# Altium schematic sheet Battery System.SchDoc
size A4; SheetNumber: 3; SheetTotal: 5
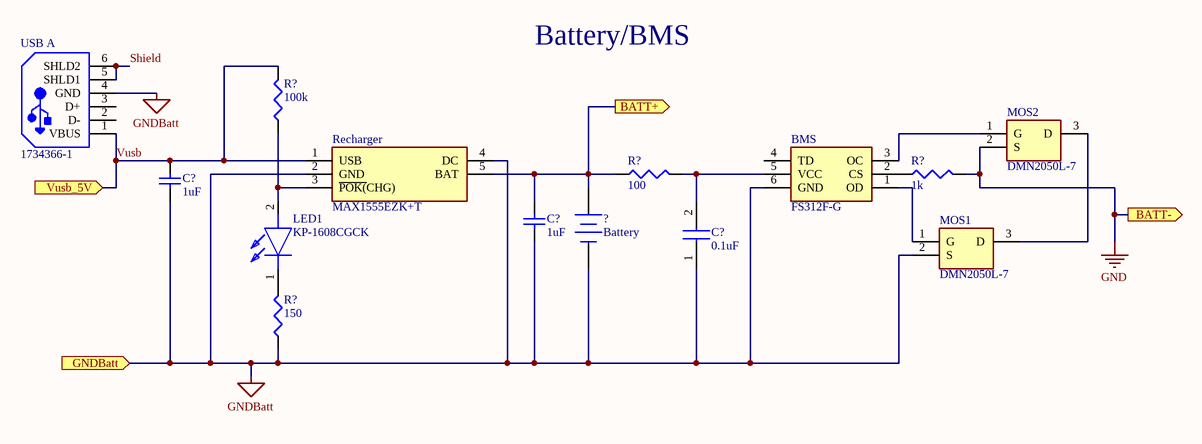
[diagram p0: Battery System.SchDoc]

## Parts
(Parts that share a designator on the sheet are numbered #1, #2 ... from top to bottom, then left to right.)
?  Battery  [BAT-2]
BMS  FS312F-G  [SOT95P280X145-6N]
C?#1  1uF  [CAPC1608X90X35ML15T15]
C?#2  1uF  [CAPC1608X90X35ML15T15]
C?#3  0.1uF  [CAPC3216X180N]
LED1  KP-1608CGCK  [LEDC1608X120N]
MOS1  DMN2050L-7  [SOT96P240X120-3N]
MOS2  DMN2050L-7  [SOT96P240X120-3N]
R?#1  value 100k  [J1-0603]  (hidden comment: Res3)
R?#2  value 100  [J1-0603]  (hidden comment: Res3)
R?#3  value 1k  [J1-0603]  (hidden comment: Res3)
R?#4  value 150  [J1-0603]  (hidden comment: Res3)
Recharger  MAX1555EZK+T  [SOT95P275X110-5N]
USB_A  1734366-1  [TE-1734366-1_V]

## Ports
BATT+ (out), BATT- (out), GNDBatt (in), Vusb_5V (in)

## Nets
GND: MOS2.2(S) R?#3.2 ; port BATT-
GNDBatt: ?.2(-) BMS.6(GND) C?#1.1 C?#2.1 C?#3.1 MOS1.2(S) R?#4.1 Recharger.2(GND) Recharger.4(DC) USB_A.4(GND) ; port GNDBatt
BATT+: ?.1(+) C?#2.2 R?#2.1 Recharger.5(BAT) ; port BATT+
Shield: USB_A.5(SHLD1) USB_A.6(SHLD2)
Vusb: C?#1.2 R?#1.2 Recharger.1(USB) USB_A.1(VBUS) ; port Vusb_5V
NetBMS_1: BMS.1(OD) MOS1.1(G)
NetBMS_2: BMS.2(CS) R?#3.1
NetBMS_3: BMS.3(OC) MOS2.1(G)
NetBMS_5: BMS.5(VCC) C?#3.2 R?#2.2
NetLED1_1: LED1.1(K) R?#4.2
NetLED1_2: LED1.2(A) R?#1.1 Recharger.3(~{POK(}CHG))
NetMOS1_3: MOS1.3(D) MOS2.3(D)

Not connected (* = marked no-connect by the designer): BMS 4(TD); USB_A 2(D-) 3(D+)

## Notes on the sheet
- Battery/BMS

## Library data of the parts
? = Battery: Multicell Battery; Published: 24-Mar-1999; LatestRevisionDate: 17-Jul-2002; LatestRevisionNote: Re-released for DXP Platform.; PackageReference: BAT-2; Publisher: Altium Limited; PackageDescription: Battery; 2 Leads
BMS = FS312F-G: Integrated Circuit; Manufacturer_Name: Fortune Semiconductor Corporation; Datasheet Link: https://www.ic-fortune.com/upload/Download/FS312F-G-DS-12_EN.pdf; Height: 1.45mm; Manufacturer_Part_Number: FS312F-G
C?#1 C?#2 = CMP-2006-04472-1: Manufacturer: AVX Interconnect / Elco; Part Number: 06036C105KAT2A
C?#3 = GCM31C5C1H104FA16L: Capacitor, C5C1H104FA16L; Manufacturer_Name: Murata Electronics; Datasheet Link: https://www.digikey.in/product-detail/en/murata-electronics/GCM31C5C1H104FA16L/490-GCM31C5C1H104FA16LCT-ND/11618925; Height: 1.8mm; Manufacturer_Part_Number: GCM31C5C1H104FA16L; Mouser Part Number: 81-GCM31C5C1H104FA16; Mouser Price/Stock: https://www.mouser.co.uk/ProductDetail/Murata-Electronics/GCM31C5C1H104FA16L?qs=rrS6PyfT74fke0d0BEF0PA%3D%3D; Arrow Part Number: GCM31C5C1H104FA16L; Arrow Price/Stock: https://www.arrow.com/en/products/gcm31c5c1h104fa16l/murata-manufacturing
LED1 = KP-1608CGCK: LED; Manufacturer_Name: Kingbright; Datasheet Link: https://componentsearchengine.com/Datasheets/2/KP-1608CGCK.pdf; Height: 1.2mm; Manufacturer_Part_Number: KP-1608CGCK; Mouser Part Number: N/A; Mouser Price/Stock: https://www.mouser.co.uk/ProductDetail/Kingbright/KP-1608CGCK?qs=2JU0tDl2GZ3U0MYrqLedOQ%3D%3D; Arrow Part Number: KP-1608CGCK; Arrow Price/Stock: https://www.arrow.com/en/products/kp-1608cgck/kingbright?region=europe
MOS1 MOS2 = DMN2050L-7: Discharge Control, Integrated Circuit; Manufacturer_Name: Diodes Inc.; Datasheet Link: http://uk.rs-online.com/web/p/products/8222554; Height: 1.2mm; Manufacturer_Part_Number: DMN2050L-7; Mouser Part Number: 621-DMN2050L-7; Mouser Price/Stock: https://www.mouser.co.uk/ProductDetail/Diodes-Incorporated/DMN2050L-7?qs=ptj1V1atRApKUZluT7i4SA%3D%3D; Arrow Part Number: DMN2050L-7; Arrow Price/Stock: https://www.arrow.com/en/products/dmn2050l-7/diodes-incorporated
R?#1-R?#4 = Res3: Resistor; Published: 8-Jun-2000; LatestRevisionDate: 29-May-2009; LatestRevisionNote: IPC-7351 Footprint Added.; PackageReference: J1-0603; Publisher: Altium Limited; PackageDescription: Chip Resistor
Recharger = MAX1555EZK+T: Integrated Circuit; Manufacturer_Name: Maxim Integrated; Datasheet Link: http://datasheets.maximintegrated.com/en/ds/MAX1551-MAX1555.pdf; Height: 1.1mm; Manufacturer_Part_Number: MAX1555EZK+T; Mouser Part Number: 700-MAX1555EZK+T; Mouser Price/Stock: https://www.mouser.co.uk/ProductDetail/Maxim-Integrated/MAX1555EZK%2bT?qs=LHmEVA8xxfYLEoVKeceKJA%3D%3D; Arrow Part Number: MAX1555EZK+T; Arrow Price/Stock: https://www.arrow.com/en/products/max1555ezkt/maxim-integrated?region=nac
USB_A = CMP-1684-00007-1: Recept Assy, Vertical, 4 Position, Thru-Hole, Type A USB, RoHS, Tray; Case\Package: SMA; Peak Reverse Current: 200 uA; Forward Voltage: 500 mV; Max Surge Current: 40 A; Max Operating Temperature: 125 degC; ComponentLink1URL: http://www.te.com/; Mount: Surface Mount; ComponentLink2URL: http://www.te.com/commerce/DocumentDelivery/DDEController?Action=showdoc&DocId=Customer+Drawing%7F1734366%7FC3%7Fpdf%7FEnglish%7FENG_CD_1734366_C3.pdf%7F1734366-1; ComponentLink2Description: Datasheet; Pins: 2; RoHSCompliant: true; REACH SVHC: No SVHC; Radiation Hardening: No; Min Operating Temperature: -65 degC; PackageReference: 1734366-1; PackageDescription: 6-Pin Through Hole Device, Length 15 mm, Height 15 mm, Tail Length 2.8 mm; ComponentLink1Description: Manufacturer URL; Package Quantity: 7500; DatasheetVersion: Rev. C3, 03/2016; Packaging: Tape and Reel